# EAGLE design LED Driver (EAGLE 7.4.0)
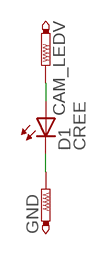
[diagram p0: schematic, sheet 1]

## Parts
CAM_LEDV  PTR1PAD1-20  [P1-20]
D1  CREE  [CREE-XLAMP-XM-L]
GND  PTR1PAD1-20  [P1-20]

## Nets
CAM_LEDV: CAM_LEDV.TP D1.A D1.A@1(A)
GND: D1.C D1.C1(C) D1.C@1(C) GND.TP

## Library data of the parts
CAM_LEDV GND = testpad:PTR1: TEST PIN
D1 = 2015_LED_Driver:CREE: Cree XBD model LED's digikey # XBDAWT-00-0000-000000F51CT-ND

## Board
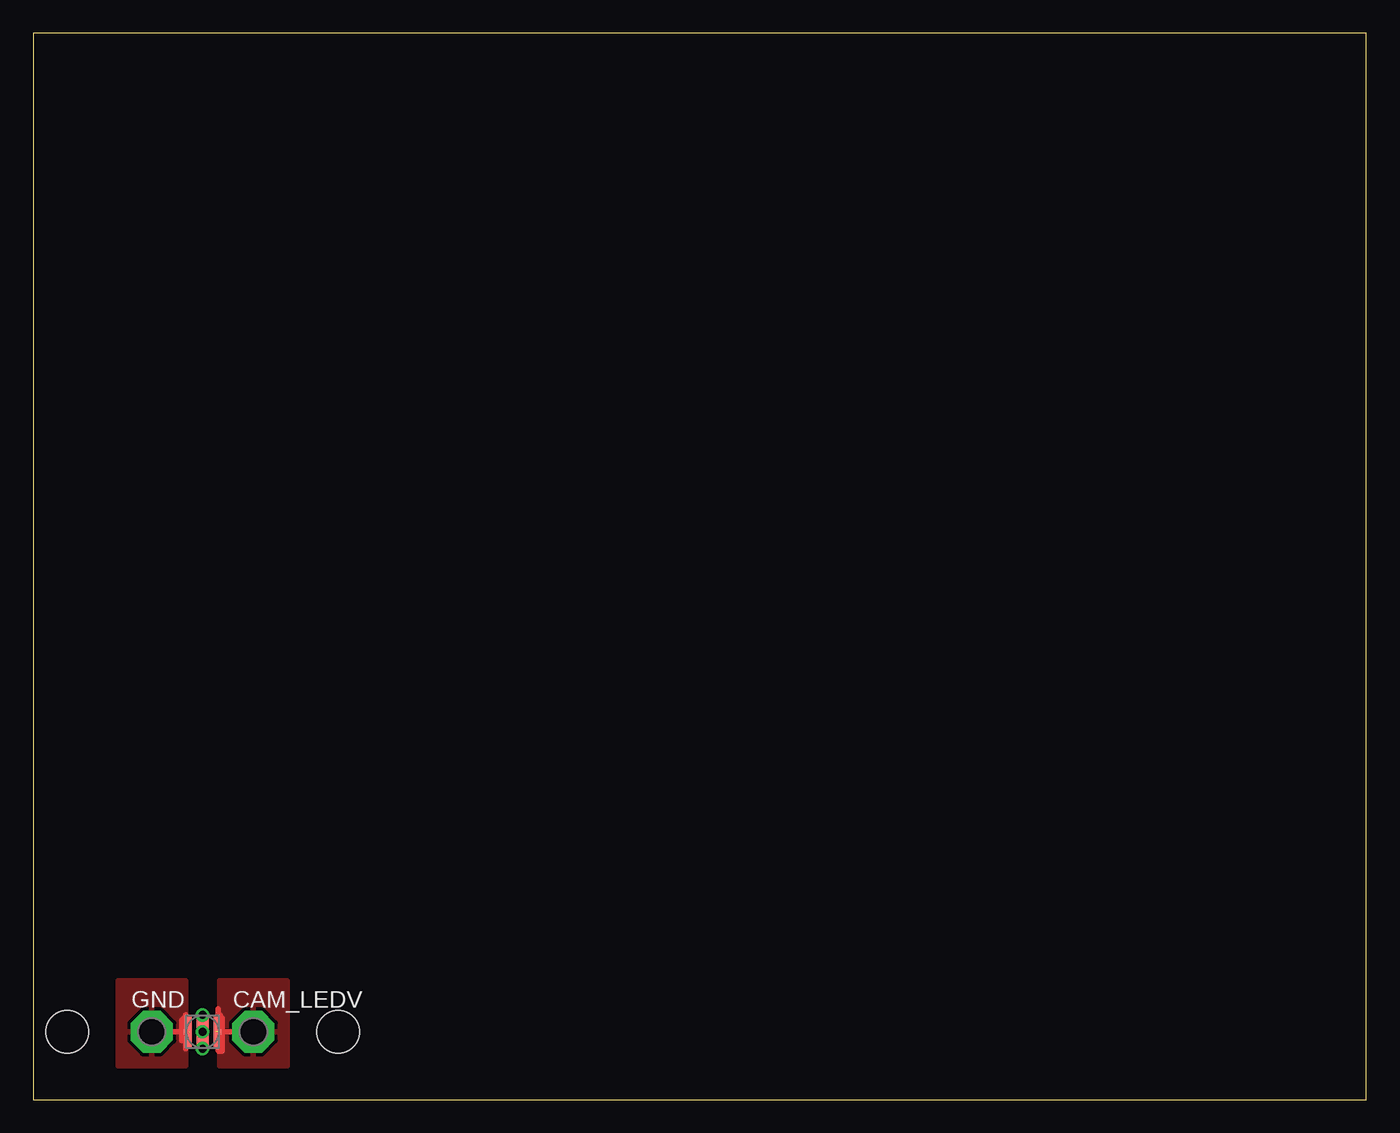
[diagram p1: board, top side]
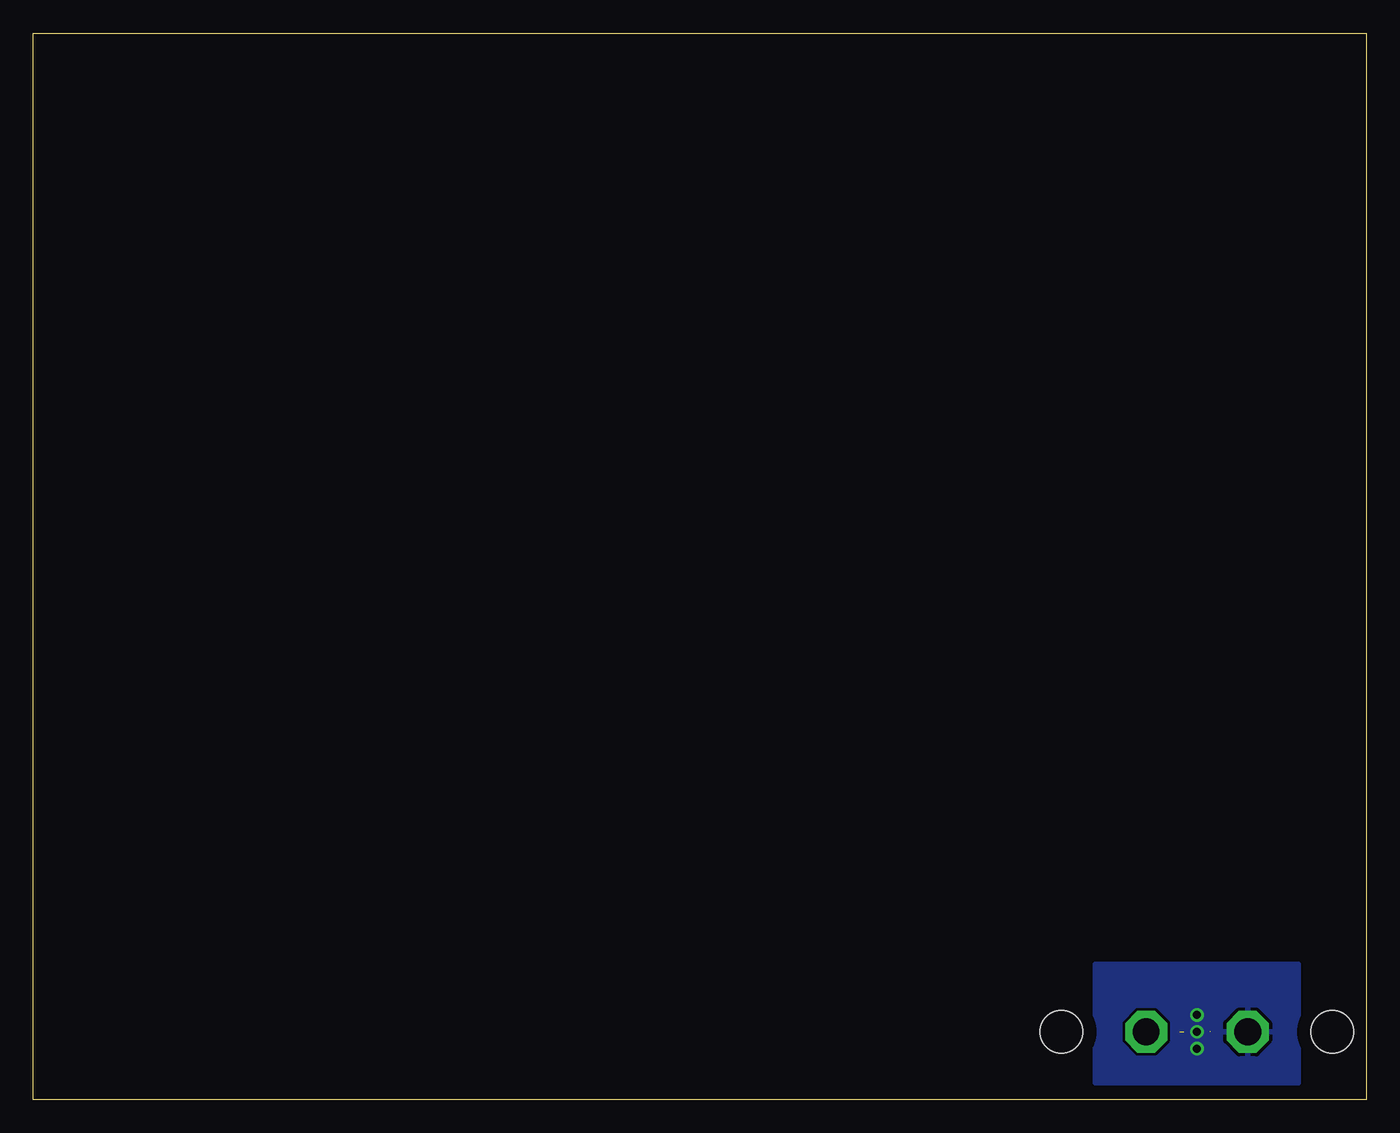
[diagram p2: board, bottom side, seen from below]

Size 100 x 80 mm. Coordinates in mm from the lower left corner, seen from the top.
Outline: 0,0 100,0 100,80 0,80 0,0
Copper layers (1*16): Top 0.035mm / dielectric 1.5mm / Bottom 0.035mm
Design rules "default": minimum track width 10mil, minimum drill 24mil, track to track 8mil, track to pad 8mil, pad to pad 8mil, via to via 8mil, smd to smd 8mil, copper to edge 40mil, drill to drill 8mil, minimum pad ring 10mil, minimum via ring 8mil, stop-mask expansion 4mil, vias tented up to drill 0mil, thermal gap 10mil
Holes 3.2 mm at 22.86,5.08 2.54,5.08

### Footprints (pad centres in the part's own frame; a part is rotated, then mirrored left to right if it is on the bottom)
P1-20 = drill 2.007 pad 3.15 octagon: TP 0,0
CREE-XLAMP-XM-L = smd 0.33 x 2.29: A 0.985,0; C1 -1,0 | smd 0.28 x 0.36: A@1 1.27,0; C@1 -1.27,0 | smd 0.36 x 2.34: C -0.985,0 | smd 0.92 x 2.29: EXP 0,0

### Placement (x,y rotation side)
CAM_LEDV  16.51,5.08 0 top
D1  12.7,5.08 0 top
GND  8.89,5.08 0 top

### Tracks (layer width: path | path; a pad name or v marks a point on that pad's centre or on a via)
CAM_LEDV  (1 unrouted)
  Top 0.305: 14.17,6.15 13.97,6.15 | 13.97,6.15 13.97,6.35 | 13.97,6.15 D1.A@1
  Top 0.406: CAM_LEDV.TP D1.A@1 | 13.87,6.81 13.87,3.68 13.92,3.63 14.15,3.63 14.17,3.66 14.17,6.15 13.97,6.35
  pour Top: 13.97,8.89 19.05,8.89 19.05,2.54 13.97,2.54
GND  (via drill 0.6 pad 0.03)  (1 unrouted)
  Top 0.305: D1.C1 D1.C@1
  Top 0.406: GND.TP D1.C@1 | D1.C@1 11.43,6.2 | 11.43,3.81 D1.C@1 | 11.43,6.35 11.43,6.2 | 11.43,6.2 11.12,5.89 11.12,4.45 11.18,4.39
  other vias: 12.7,6.35 12.7,5.08 12.7,3.81
  pour Bottom: 5.08,10.16 20.32,10.16 20.32,1.27 5.08,1.27
  pour Top: 6.35,8.89 11.43,8.89 11.43,2.54 6.35,2.54